# Altium schematic sheet White Noise.SchDoc: White Noise Generator
size Letter; SheetNumber: 10; SheetTotal: 10
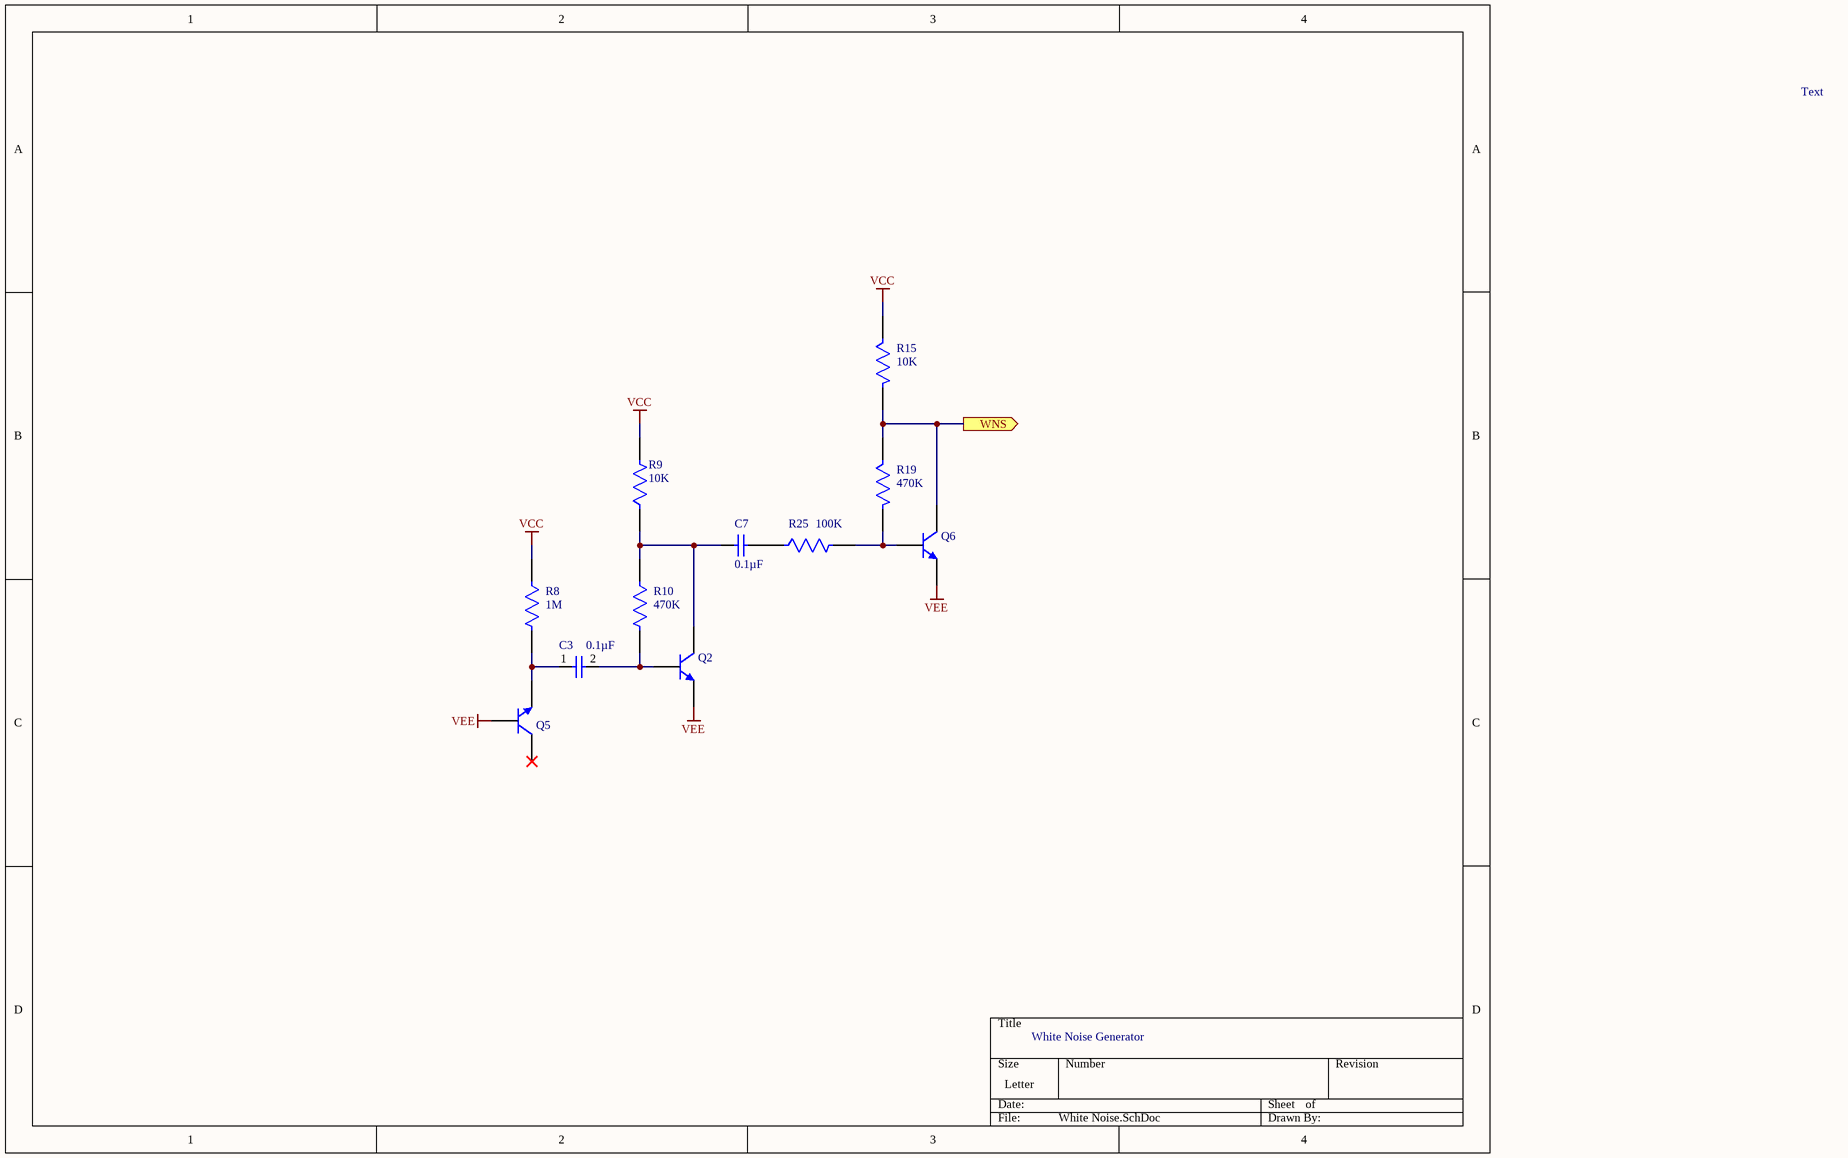
[diagram p0: White Noise.SchDoc]

## Parts
C3  Capacitance: 0.1µF  [SAMS-C0603-2_M]  (hidden comment: CL10B104KB8NNNC)
C7  Capacitance: 0.1µF  [SAMS-C0603-2_M]  (hidden comment: CL10B104KB8NNNC)
Q2  MMBT3904LT1G  [ONSC-SOT-23-3-318-08_V]  (value not drawn)
Q5  MMBT3904LT1G  [ONSC-SOT-23-3-318-08_V]  (value not drawn)
Q6  MMBT3904LT1G  [ONSC-SOT-23-3-318-08_V]  (value not drawn)
R8  Resistance: 1M  [FP-ESR03-IPC_B]  (hidden comment: ESR03EZPJ105)
R9  Resistance: 10K  [FP-ESR03-IPC_B]  (hidden comment: ESR03EZPJ103)
R10  Resistance: 470K  [FP-ESR03-IPC_B]  (hidden comment: ESR03EZPJ474)
R15  Resistance: 10K  [FP-ESR03-IPC_B]  (hidden comment: ESR03EZPJ103)
R19  Resistance: 470K  [FP-ESR03-IPC_B]  (hidden comment: ESR03EZPJ474)
R25  Resistance: 100K  [FP-ESR03-IPC_B]  (hidden comment: ESR03EZPJ104)

## Ports
WNS (out)

## Nets
VCC: R8.1 R9.2 R15.1
VEE: Q2.2(E) Q5.1(B) Q6.2(E)
WNS: Q6.3(C) R15.2 R19.1 ; port WNS
NetC3_1: C3.1 Q5.2(E) R8.2
NetC3_2: C3.2 Q2.1(B) R10.2
NetC7_1: C7.1 R25.1
NetC7_2: C7.2 Q2.3(C) R9.1 R10.1
NetQ6_1: Q6.1(B) R19.2 R25.2

Not connected (* = marked no-connect by the designer): Q5 3(C)*

## Notes on the sheet
- Text

## Library data of the parts
C3 C7 = CMP-2000-05332-1: Multi-layer Ceramic Capacitor, -55 to 125 degC, 2-Pin SMD (0603), RoHS, Tape and Reel; Manufacturer: Samsung Electro-Mechanics; Rated Voltage: 50V; Dielectric: X7R; Tolerance (%): ±10%; Case Size/Dimension: 0603; Datasheet URL: https://datasheet.ciiva.com/29198/456651-da-01-en-vs-kondensator-0605-29198839.pdf; Manufacturer URL: http://www.samsungsem.com/global/index.jsp; Datasheet Version: Nov-10
Q2 Q5 Q6 = CMP-1048-00631-1: General Purpose Transistor, NPN Silicon, 3-Pin SOT-23, Pb-Free, Tape and Reel; Manufacturer: On Semiconductor; Manufacturer Part Number: MMBT3904,215; IC Continuous (A): 0.2; fT Min (MHz): 300; ComponentLink2Description: Datasheet; Polarity: NPN; PackageDescription: 3-Pin Small Outline Transistor, Body 2.92 x 1.3 mm, Pitch 0.95 mm; ComponentLink2URL: http://www.onsemi.cn/pub_link/Collateral/MMBT3904LT1-D.PDF; DatasheetVersion: Rev. 12; Mounting Technology: Surface Mount; PartNumber: MMBT3904LT1G; ComponentLink1URL: http://www.onsemi.com/; ComponentLink3Description: Package Specification; ComponentLink1Description: Manufacturer URL; PackageVersion: Rev. AP, 11/2009; PackageReference: SOT-23-3-318-08; Packing: Tape and Reel; ComponentLink3URL: http://www.onsemi.cn/pub_link/Collateral/318-08.PDF; RoHS: TRUE; Supplier 1: Digi-Key; Supplier Part Number 1: 1727-4044-1-ND; Category: BJTs; Stock 1: 165643; Pricing 1: 1=0.10000, 10=0.06500, 25=0.06200, 100=0.03500, 500=0.02750, 1000=0.01910 (USD); RoHS Compliant: Yes; ComponentLink4URL: http://www.farnell.com/datasheets/2328888.pdf?src-supplier=Farnell; ComponentLink4Description: http://www.farnell.com/datasheets/2328888.pdf?src-supplier=Farnell; ComponentLink5URL: https://assets.nexperia.com/documents/data-sheet/MMBT3904.pdf?src-supplier=Digi-Key; ComponentLink5Description: https://assets.nexperia.com/documents/data-sheet/MMBT3904.pdf?src-supplier=Digi-Key; ComponentLink6URL: http://www.farnell.com/datasheets/2328888.pdf?src-supplier=Newark; ComponentLink6Description: http://www.farnell.com/datasheets/2328888.pdf?src-supplier=Newark
R8 = CMP-08839-029147-1: 1MΩ ±5% 0.25W 0603 Anti-Surge Chip Resistor AEC-Q200; Max Power Dissipation: 250mW; Temperature Coefficient: 200ppm/°C; Width: 0.031inch; Package Quantity: 1; Case/Package: 0603; Features: Automotive AEC-Q200; Packaging: Cut Tape; Case Code (Metric): 1608; Number of Terminations: 2; Series: ESR; Max Operating Temperature: 155°C; Resistor Type: Thick Film; RoHS Compliant: Yes; Min Operating Temperature: -55°C; Height: 0.022inch; Length: 0.063inch; Tolerance: 5%; Case Code (Imperial): 0603
R9 R15 = CMP-08839-028975-1: 10kΩ ±5% 0.25W 0603 Anti-Surge Chip Resistor AEC-Q200; Power Rating: 250mW; Temperature Coefficient: 200ppm/°C; Tolerance: 5%; Series: ESR03; Package Quantity: 5000; Length: 0.063inch; Height: 0.022inch; Lead Free: Lead Free; Case/Package: 0603; Case Code (Metric): 1608; Width: 0.031inch; Resistor Type: Thick Film; Max Power Dissipation: 250mW; Packaging: Tape and Reel; Mount: Surface Mount; Number of Terminations: 2; Case Code (Imperial): 0603; Max Operating Temperature: 155°C; Min Operating Temperature: -55°C; RoHS Compliant: Yes
R10 R19 = CMP-08839-028761-1: 470kΩ ±5% 0.25W 0603 Anti-Surge Chip Resistor AEC-Q200; Temperature Coefficient: 200ppm/°C; Max Power Dissipation: 250mW; RoHS Compliant: Yes; Packaging: Cut Tape; Max Operating Temperature: 155°C; Package Quantity: 5000; Resistor Type: Thick Film; Min Operating Temperature: -55°C; Number of Terminations: 2; Features: Automotive AEC-Q200; Tolerance: 5%; Width: 0.031inch; Case Code (Metric): 1608; Length: 0.063inch; Case/Package: 0603; Height: 0.022inch; Case Code (Imperial): 0603; Series: ESR
R25 = CMP-08839-029521-1: 100kΩ ±5% 0.25W 0603 Anti-Surge Chip Resistor AEC-Q200; Power Rating: 200mW; Max Power Dissipation: 250mW; Temperature Coefficient: 200ppm/°C; Length: 0.063inch; Case Code (Imperial): 0603; Case/Package: 0603; Resistor Type: Thick Film; Features: Automotive AEC-Q200; Package Quantity: 1; Width: 0.031inch; Packaging: Cut Tape; Min Operating Temperature: -55°C; Series: ESR; RoHS Compliant: Yes; Size Code: 0603; Tolerance: 5%; Height: 0.022inch; Max Operating Temperature: 155°C; Lead Free: Lead Free; Case Code (Metric): 1608; Number of Terminations: 2